# Altium schematic sheet PX4FMUv2.4.6_05.SchDoc: PX4FMUv2.4.6.sch
size 282 x 200 mm; Date: 2015/3/26 21:06:18; SheetNumber: Sheet:
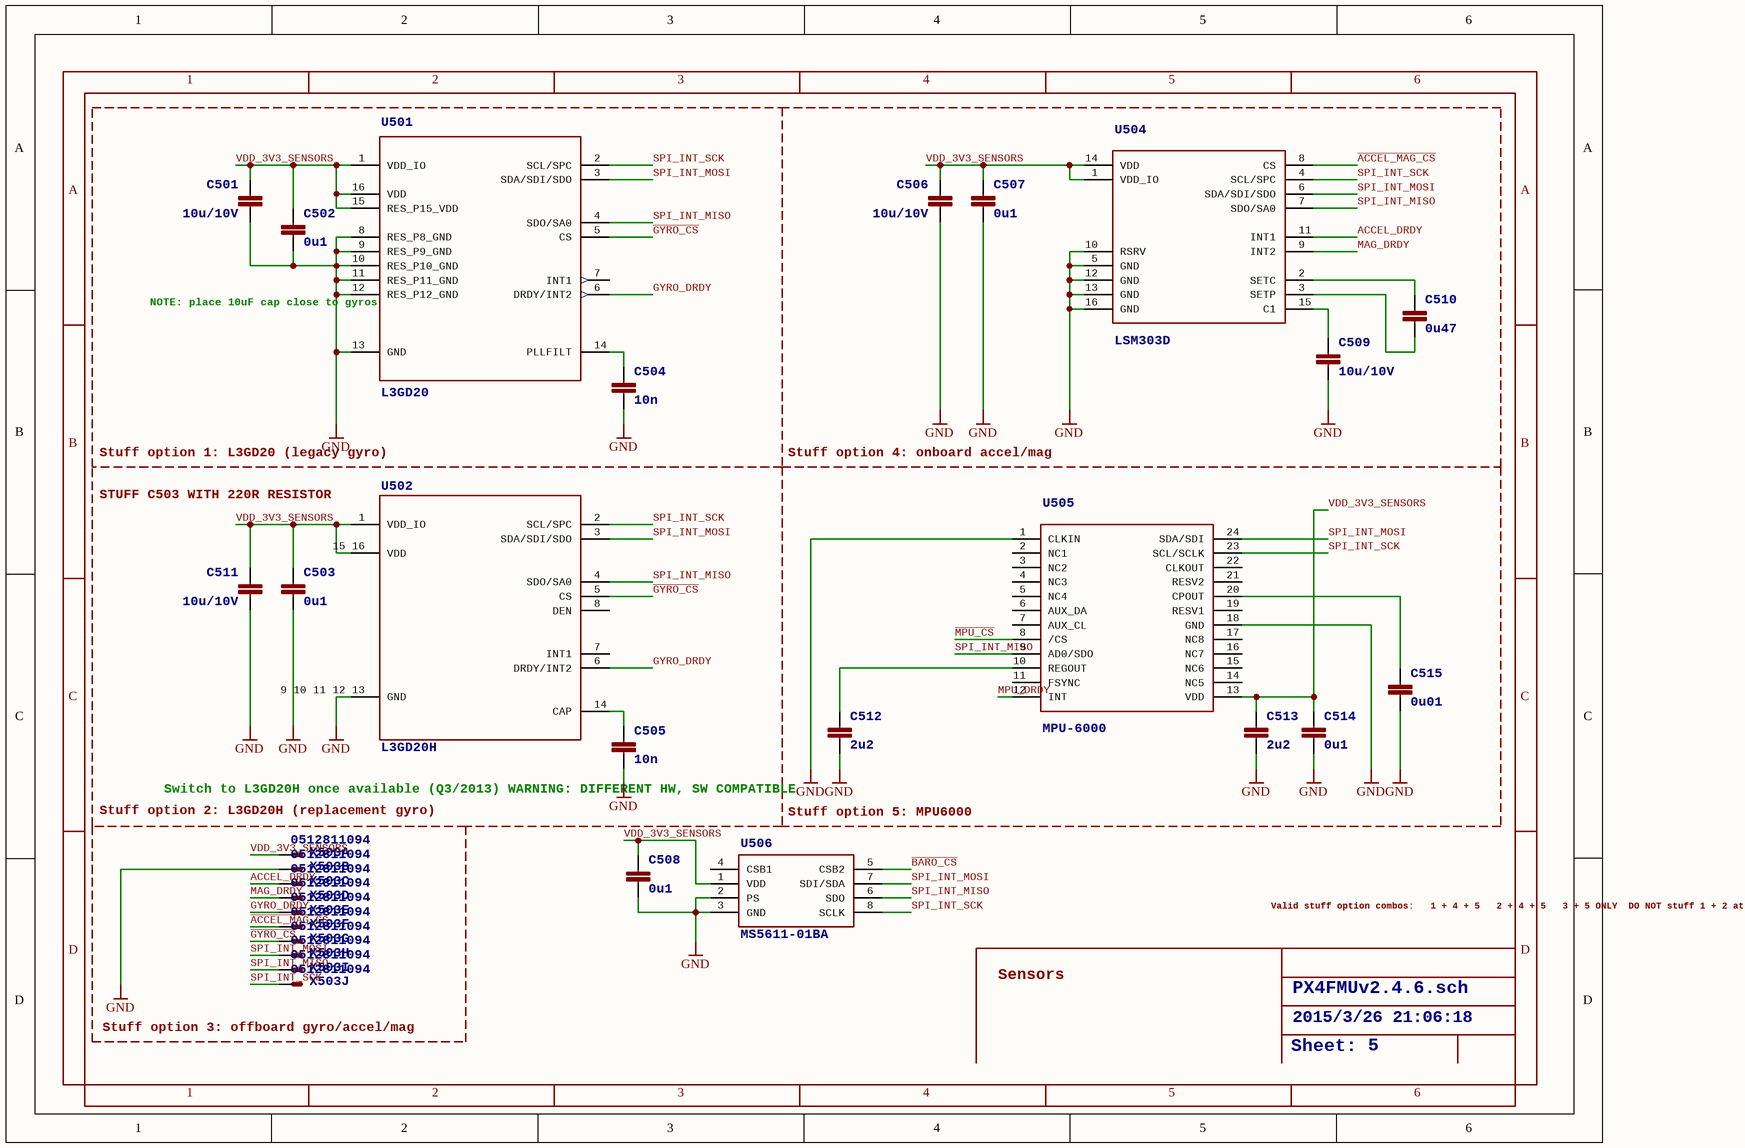
[diagram p0: PX4FMUv2.4.6_05.SchDoc]

## Parts
C501  10u/10V  [0805-CAP]
C502  0u1  [0402-CAP]
C503  0u1  [0402-CAP]
C504  10n  [0402-CAP]
C505  10n  [0402-CAP]
C506  10u/10V  [0805-CAP]
C507  0u1  [0402-CAP]
C508  0u1  [0402-CAP]
C509  10u/10V  [0805-CAP]
C510  0u47  [0402-CAP]
C511  10u/10V  [0805-CAP]
C512  2u2  [0603-CAP]
C513  2u2  [0603-CAP]
C514  0u1  [0402-CAP]
C515  0u01  [0603-CAP]
U501  L3GD20  [L3G4200DH-MAN]
U502  L3GD20H  [LGA-16L]
U504  LSM303D  [LGA-16L]
U505  MPU-6000  [QFN-24]
U506  MS5611-01BA  [MS5611-01BA]
X503  0512811094  [51281-1094]  (parts A,B,C,D,E,F,G,H,I,J of 10)

## Nets
GND: C501.P$2 C502.P$2 C503.P$2 C504.P$2 C505.P$2 C506.P$2 C507.P$2 C508.P$2 C509.P$2 C511.P$2 C512.P$2 C513.P$2 C514.P$2 C515.P$2 U501.8(RES_P8_GND) U501.9(RES_P9_GND) U501.10(RES_P10_GND) U501.11(RES_P11_GND) U501.12(RES_P12_GND) U501.13(GND) U502.9_10_11_12_13(GND) U504.5(GND) U504.10(RSRV) U504.12(GND) U504.13(GND) U504.16(GND) U505.1(CLKIN) U505.18(GND) U506.2(PS) U506.3(GND) X503.2(S)
~{ACCEL_MAG_CS}: U504.8(CS) X503.6(S)
ACCEL_DRDY: U504.11(INT1) X503.3(S)
~{BARO_CS}: U506.5(CSB2)
~{GYRO_CS}: U501.5(CS) U502.5(CS) X503.7(S)
GYRO_DRDY: U501.6(DRDY/INT2) U502.6(DRDY/INT2) X503.5(S)
~{MPU_CS}: U505.8(/CS)
MAG_DRDY: U504.9(INT2) X503.4(S)
MPU_DRDY: U505.12(INT)
SPI_INT_MISO: U501.4(SDO/SA0) U502.4(SDO/SA0) U504.7(SDO/SA0) U505.9(AD0/SDO) U506.6(SDO) X503.9(S)
SPI_INT_MOSI: U501.3(SDA/SDI/SDO) U502.3(SDA/SDI/SDO) U504.6(SDA/SDI/SDO) U505.24(SDA/SDI) U506.7(SDI/SDA) X503.8(S)
SPI_INT_SCK: U501.2(SCL/SPC) U502.2(SCL/SPC) U504.4(SCL/SPC) U505.23(SCL/SCLK) U506.8(SCLK) X503.10(S)
VDD_3V3_SENSORS: C501.P$1 C502.P$1 C503.P$1 C506.P$1 C507.P$1 C508.P$1 C511.P$1 C513.P$1 C514.P$1 U501.1(VDD_IO) U501.15(RES_P15_VDD) U501.16(VDD) U502.1(VDD_IO) U502.15_16(VDD) U504.1(VDD_IO) U504.14(VDD) U505.13(VDD) U506.1(VDD) X503.1(S)
NetC504_P$1: C504.P$1 U501.14(PLLFILT)
NetC505_P$1: C505.P$1 U502.14(CAP)
NetC509_P$1: C509.P$1 U504.15(C1)
NetC510_P$1: C510.P$1 U504.2(SETC)
NetC510_P$2: C510.P$2 U504.3(SETP)
NetC512_P$1: C512.P$1 U505.10(REGOUT)
NetC515_P$1: C515.P$1 U505.20(CPOUT)

Not connected (* = marked no-connect by the designer): U501 7(INT1); U502 7(INT1) 8(DEN); U505 2(NC1) 3(NC2) 4(NC3) 5(NC4) 6(AUX_DA) 7(AUX_CL) 11(FSYNC) 14(NC5) 15(NC6) 16(NC7) 17(NC8) 19(RESV1) 21(RESV2) 22(CLKOUT); U506 4(CSB1)

## Notes on the sheet
- NOTE: place 10uF cap
  close to gyros
- Stuff option 1: L3GD20 (legacy gyro)
- STUFF C503 WITH 220R RESISTOR
- Stuff option 4: onboard accel/mag
- (near C505) Switch to L3GD20H
  once available (Q3/2013)
  WARNING: DIFFERENT HW,
  SW COMPATIBLE
- (near X503) Stuff option 2: L3GD20H (replacement gyro)
- Stuff option 5: MPU6000
- Valid stuff option combos:
  1 + 4 + 5
  2 + 4 + 5
  3 + 5 ONLY
  DO NOT stuff 1 + 2 at the same time
  DO NOT stuff 3 with any of 1, 2 or 4
- Sensors
- (near X503) Stuff option 3: offboard gyro/accel/mag
- 1
- 2
- 3
- 4
- 5
- 6
- A
- B
- C
- D

## Library data of the parts
C501 C506 C509 C511 = CAP0805: <b>Capacitor</b> / Standard 0603 ceramic capacitor, and 0.1" leaded capacitor.; PARTNO: CC0805ZKY5V6BB106
C502 C503 C507 C508 C514 = CAP0402: <b>Capacitor</b> / Standard 0603 ceramic capacitor, and 0.1" leaded capacitor.; PARTNO: CC0402ZRY5V7BB104
C504 C505 = CAP0402: <b>Capacitor</b> / Standard 0603 ceramic capacitor, and 0.1" leaded capacitor.; PARTNO: CC0402KRX7R7BB103
C510 = CAP0402: <b>Capacitor</b> / Standard 0603 ceramic capacitor, and 0.1" leaded capacitor.; PARTNO: C1005X5R1C474K050BC
C512 C513 = CAP0603: <b>Capacitor</b> / Standard 0603 ceramic capacitor, and 0.1" leaded capacitor.; PARTNO: C1608X6S1C225K080AC
C515 = CAP0603: <b>Capacitor</b> / Standard 0603 ceramic capacitor, and 0.1" leaded capacitor.; PARTNO: 06033C103JAT2A
U501 = L3G4200DH-LL: <h3>L3G4200DH - Digital 3-axis Gyroscope</h3> / The L3G4200DH is a low-power three-axis / angular rate sensor. The L3G4200DH has a full scale of ±250/±500/ / ±2000 dps and is capable of measuring rates with / a user-selectable bandwidth. It can operate within a / temperature range from -40 °C to +85 °C. Supply voltage: 2.4 V to 3.6 V. Full datasheet:<br /><br /> / <a href="http://www.st.com/stonline/products/literature/ds/17300.pdf">L3G4200DH Datasheet</a>; PARTNO: L3GD20
U502 = L3GD20H: <b>L3GD20H MEMS motion sensor: 3-axis digital output gyroscope</b>; BOM: EXCLUDE; DATASHEET: http://www.st.com/internet/com/TECHNICAL_RESOURCES/TECHNICAL_LITERATURE/DATASHEET/DM00060659.pdf; LINK: http://www.st.com/internet/analog/product/254039.jsp; MFGPN: L3GD20H; PARTNO: L3GD20H
U504 = LSM303D: <b>LSM303D Ultra compact high performance e-compass: 3D accelerometer and 3D magnetometer module</b>; DATASHEET: http://www.st.com/internet/com/TECHNICAL_RESOURCES/TECHNICAL_LITERATURE/DATASHEET/DM00057547.pdf; LINK: http://www.st.com/internet/analog/product/253884.jsp; MFGPN: LSM303D; PARTNO: LSM303D
U505 = MPU-6000: <b>Invensense MPU-6000: 3-axis gyro, 3-axis accel & 9-axis MotionFusion</b> / <br> / <br> / The MPU-60X0 Motion Processing Unit (MPU?) is the world?s first motion processing solution with / integrated 9-axis sensor fusion for handset and tablet applications, game controllers, motion pointer remote / controls, and other consumer devices. The MPU-60X0 has an embedded 3-axis MEMS gyroscope, 3-axis / MEMS accelerometer and Digital Motion Processor? (DMP) hardware accelerator engine with an auxiliary / I / 2 / C port that interfaces to third party digital sensors, such as magnetometers. Interfacing with a 3-axis / magnetometer delivers a complete 9-axis sensor fusion output to the MPU?s primary I / 2 / C or SPI port. (SPI is / available on MPU-6000 only). This combines acceleration and rotational motion plus heading information into / a single data stream for the application; DATASHEET: http://invensense.com/mems/gyro/documents/PS-MPU-6000A-00_v1.0.pdf; LINK: http://invensense.com/mems/gyro/mpu6000.html; MFGPN: MPU-6000; PARTNO: MPU-6000
U506 = MS5611-01BA: <b>MS5611-01BA</b> / <p>The MS5611-01BA is a new generation of high resolution altimeter sensors from MEAS Switzerland with SPI / and I / 2 / C bus interface. It is optimized for altimeters and  variometers with an altitude resolution of 10 cm. The / sensor module includes a high linearity pressure sensor and an ultra low power 24 bit ?? ADC with internal / factory calibrated coefficients. It provides a precise digital 24 Bit pressure and temperature value and different / operation modes that allow the user to optimize for conversion speed and current consumption. A high / resolution temperature output allows the implementation of an altimeter/thermometer function without any / additional sensor. The MS5611-01BA can be interfaced to virtually any microcontroller. The communication / protocol is simple, without the need of programming internal registers in the device. Small dimensions of only / 5.0 mm x 3.0 mm and a height of 1.7 mm allow for integration in mobile devices. This new sensor module / generation is based on leading MEMS technology and latest benefits from  MEAS Switzerland proven / experience and know-how in high volume manufacturing of altimeter modules, which have been widely used for / over a decade. The sensing principle employed leads to very low hysteresis and high stability of both pressure / and temperature signal.</p> / <ul> / <li>High resolution module, 10 cm </li> / <li>Fast conversion down to 1 ms </li> / <li>Low power, 1 µA (standby < 0.15 µA) </li> / <li>QFN package 5.0 x 3.0 x 1.7 mm3</li> / <li>Supply voltage 1.8 to 3.6 V </li> / <li>Integrated digital pressure sensor (24 bit ?? ADC) </li> / <li>Operating range: 10 to 1200 mbar, -40 to +85 °C </li> / <li>I2C and SPI interface up to 20 MHz </li> / <li>No external components (Internal oscillator) </li> / <li>Excellent long term stability</li> / </ul>; DATASHEET: http://www.meas-spec.com/downloads/MS5611-01BA01.pdf; LINK: http://www.meas-spec.com/product/t_product.aspx?id=8503#; MFGPN: MS5611-01BA; PARTNO: MS5611-01BA
X503 = CONN_FPC_10RA: 10-pin FPC connector for PX4 sensor board; PARTNO: 0781191109; BOM: EXCLUDE